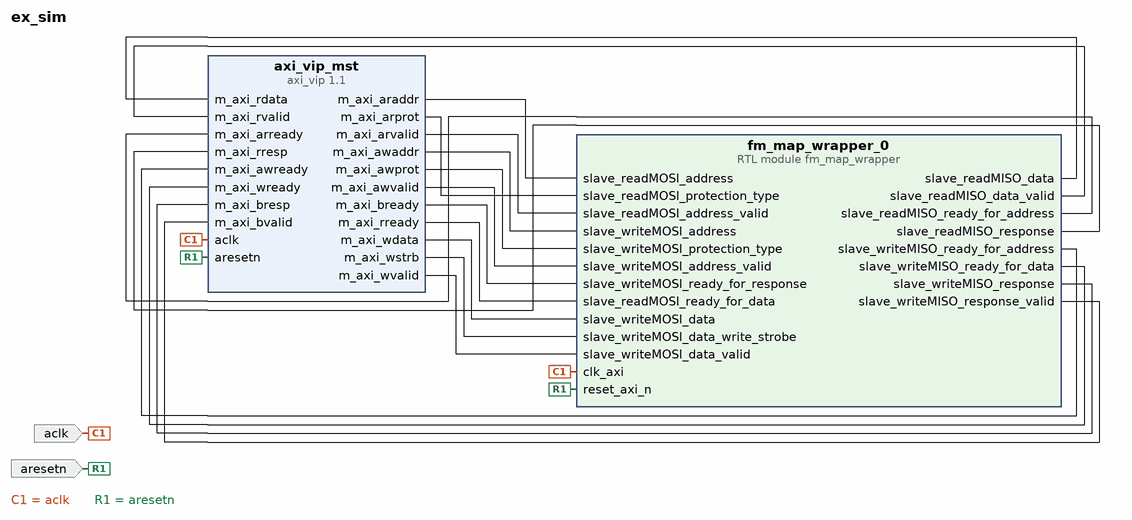
[diagram p0: block diagram of the top level]
# Vivado block design ex_sim, xcku15p-ffva1760-2-e, Vivado 2020.2
create_bd_design ex_sim

create_bd_port -dir I -type clk aclk
set_property -dict [list \
  CONFIG.CLK_DOMAIN design_sim_clk_wiz_0_0_clk_out1 \
  CONFIG.FREQ_HZ 300000000 \
  CONFIG.PHASE 0.0 \
] [get_bd_ports aclk]
create_bd_port -dir I -type rst aresetn
set_property -dict {CONFIG.POLARITY ACTIVE_LOW} [get_bd_ports aresetn]

create_bd_cell -type ip -vlnv xilinx.com:ip:axi_vip:1.1 axi_vip_mst
set_property -dict [list \
  CONFIG.ADDR_WIDTH 32 \
  CONFIG.DATA_WIDTH 32 \
  CONFIG.HAS_ACLKEN 0 \
  CONFIG.HAS_ARESETN 1 \
  CONFIG.HAS_BRESP 1 \
  CONFIG.HAS_PROT 1 \
  CONFIG.HAS_RRESP 1 \
  CONFIG.HAS_WSTRB 1 \
  CONFIG.INTERFACE_MODE MASTER \
  CONFIG.PROTOCOL AXI4LITE \
  CONFIG.READ_WRITE_MODE READ_WRITE \
] [get_bd_cells axi_vip_mst]
create_bd_cell -type module -reference fm_map_wrapper fm_map_wrapper_0

# ---- connections ----

connect_bd_net [get_bd_ports aclk] [get_bd_pins axi_vip_mst/aclk] [get_bd_pins fm_map_wrapper_0/clk_axi]
connect_bd_net [get_bd_ports aresetn] [get_bd_pins axi_vip_mst/aresetn] [get_bd_pins fm_map_wrapper_0/reset_axi_n]
connect_bd_net [get_bd_pins axi_vip_mst/m_axi_araddr] [get_bd_pins fm_map_wrapper_0/slave_readMOSI_address]
connect_bd_net [get_bd_pins axi_vip_mst/m_axi_arprot] [get_bd_pins fm_map_wrapper_0/slave_readMOSI_protection_type]
connect_bd_net [get_bd_pins axi_vip_mst/m_axi_arvalid] [get_bd_pins fm_map_wrapper_0/slave_readMOSI_address_valid]
connect_bd_net [get_bd_pins axi_vip_mst/m_axi_awaddr] [get_bd_pins fm_map_wrapper_0/slave_writeMOSI_address]
connect_bd_net [get_bd_pins axi_vip_mst/m_axi_awprot] [get_bd_pins fm_map_wrapper_0/slave_writeMOSI_protection_type]
connect_bd_net [get_bd_pins axi_vip_mst/m_axi_awvalid] [get_bd_pins fm_map_wrapper_0/slave_writeMOSI_address_valid]
connect_bd_net [get_bd_pins axi_vip_mst/m_axi_bready] [get_bd_pins fm_map_wrapper_0/slave_writeMOSI_ready_for_response]
connect_bd_net [get_bd_pins axi_vip_mst/m_axi_rready] [get_bd_pins fm_map_wrapper_0/slave_readMOSI_ready_for_data]
connect_bd_net [get_bd_pins axi_vip_mst/m_axi_wdata] [get_bd_pins fm_map_wrapper_0/slave_writeMOSI_data]
connect_bd_net [get_bd_pins axi_vip_mst/m_axi_wstrb] [get_bd_pins fm_map_wrapper_0/slave_writeMOSI_data_write_strobe]
connect_bd_net [get_bd_pins axi_vip_mst/m_axi_wvalid] [get_bd_pins fm_map_wrapper_0/slave_writeMOSI_data_valid]
connect_bd_net [get_bd_pins fm_map_wrapper_0/slave_readMISO_data] [get_bd_pins axi_vip_mst/m_axi_rdata]
connect_bd_net [get_bd_pins fm_map_wrapper_0/slave_readMISO_data_valid] [get_bd_pins axi_vip_mst/m_axi_rvalid]
connect_bd_net [get_bd_pins fm_map_wrapper_0/slave_readMISO_ready_for_address] [get_bd_pins axi_vip_mst/m_axi_arready]
connect_bd_net [get_bd_pins fm_map_wrapper_0/slave_readMISO_response] [get_bd_pins axi_vip_mst/m_axi_rresp]
connect_bd_net [get_bd_pins fm_map_wrapper_0/slave_writeMISO_ready_for_address] [get_bd_pins axi_vip_mst/m_axi_awready]
connect_bd_net [get_bd_pins fm_map_wrapper_0/slave_writeMISO_ready_for_data] [get_bd_pins axi_vip_mst/m_axi_wready]
connect_bd_net [get_bd_pins fm_map_wrapper_0/slave_writeMISO_response] [get_bd_pins axi_vip_mst/m_axi_bresp]
connect_bd_net [get_bd_pins fm_map_wrapper_0/slave_writeMISO_response_valid] [get_bd_pins axi_vip_mst/m_axi_bvalid]

validate_bd_design
save_bd_design
